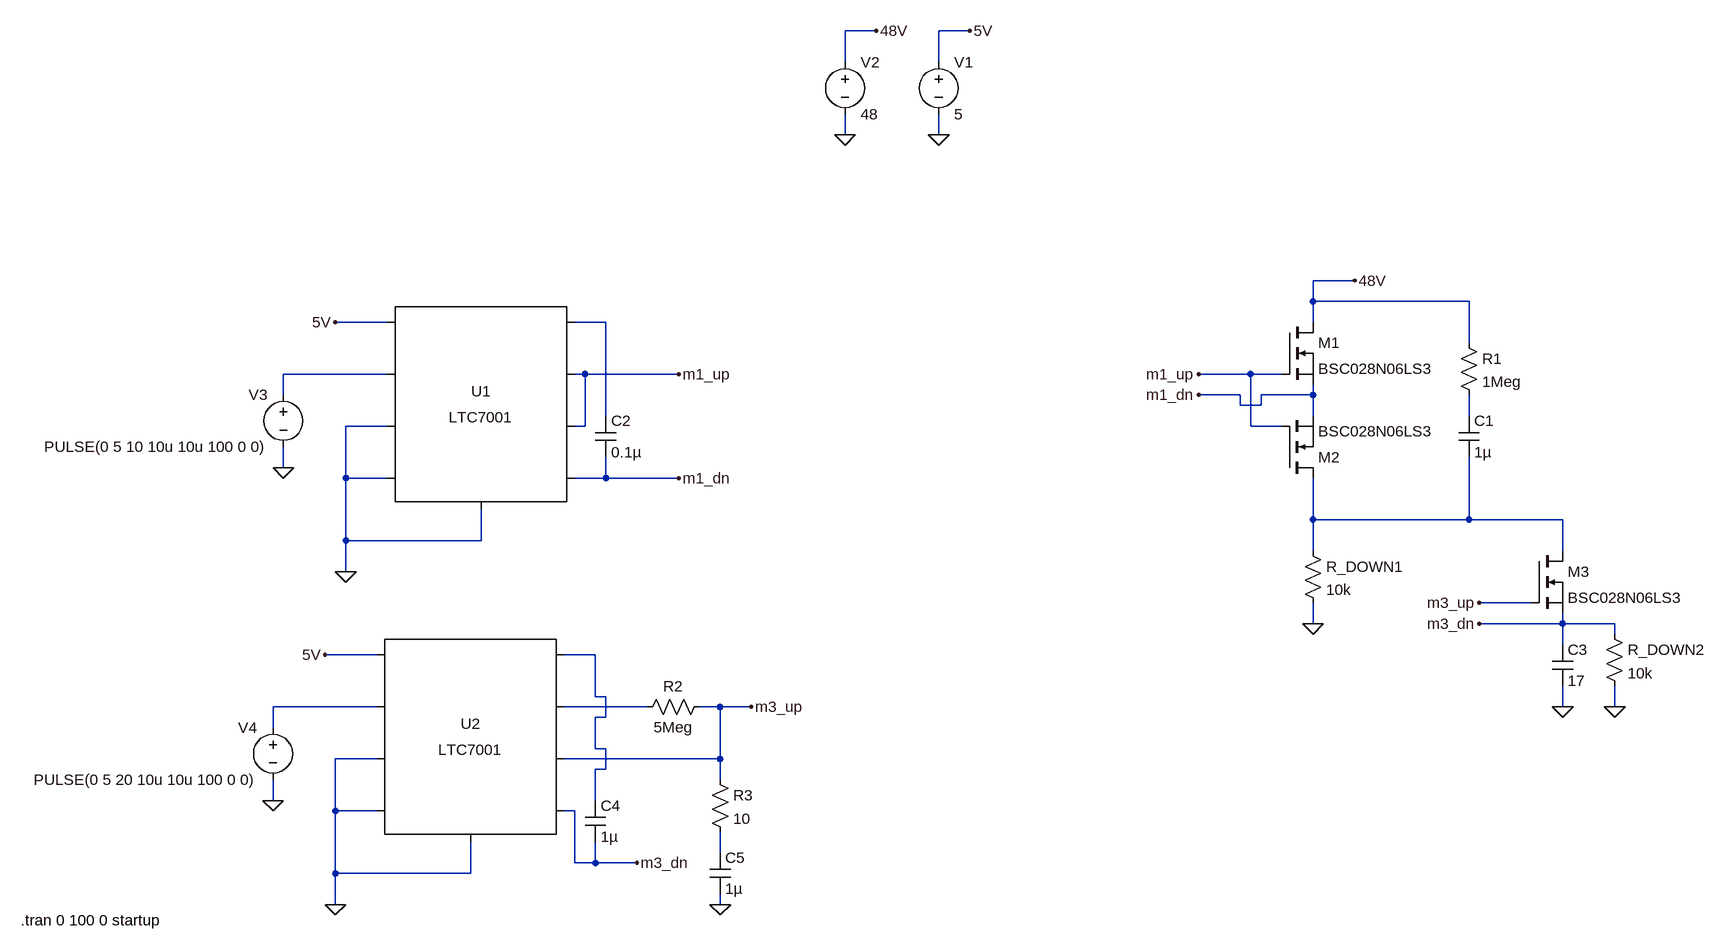
[diagram p0: schematic Draft1.asc]
Draft1.asc, the LTspice schematic file:
Version 4
SHEET 1 880 952
WIRE -688 -432 -736 -432
WIRE -544 -432 -592 -432
WIRE -736 -384 -736 -432
WIRE -592 -384 -592 -432
WIRE -736 -272 -736 -304
WIRE -592 -272 -592 -304
WIRE 48 -48 -16 -48
WIRE -16 -16 -16 -48
WIRE 224 -16 -16 -16
WIRE -1440 16 -1520 16
WIRE -1104 16 -1152 16
WIRE -16 16 -16 -16
WIRE 224 48 224 -16
WIRE -1440 96 -1600 96
WIRE -1136 96 -1152 96
WIRE -992 96 -1136 96
WIRE -112 96 -192 96
WIRE -64 96 -112 96
WIRE -1600 128 -1600 96
WIRE -128 128 -192 128
WIRE -16 128 -16 112
WIRE -16 128 -96 128
WIRE -128 144 -128 128
WIRE -96 144 -96 128
WIRE -96 144 -128 144
WIRE -1104 160 -1104 16
WIRE -16 160 -16 128
WIRE 224 160 224 128
WIRE -1440 176 -1504 176
WIRE -1136 176 -1136 96
WIRE -1136 176 -1152 176
WIRE -112 176 -112 96
WIRE -64 176 -112 176
WIRE -1600 240 -1600 208
WIRE -1504 256 -1504 176
WIRE -1440 256 -1504 256
WIRE -1104 256 -1104 224
WIRE -1104 256 -1152 256
WIRE -992 256 -1104 256
WIRE -16 320 -16 256
WIRE 224 320 224 224
WIRE 224 320 -16 320
WIRE 368 320 224 320
WIRE -1504 352 -1504 256
WIRE -1296 352 -1296 304
WIRE -1296 352 -1504 352
WIRE -16 368 -16 320
WIRE 368 368 368 320
WIRE -1504 400 -1504 352
WIRE 320 448 240 448
WIRE -16 480 -16 448
WIRE 368 480 368 464
WIRE 368 480 240 480
WIRE 448 480 368 480
WIRE 448 496 448 480
WIRE 368 512 368 480
WIRE -1456 528 -1536 528
WIRE -1120 528 -1168 528
WIRE -1120 592 -1120 528
WIRE -1104 592 -1120 592
WIRE -1456 608 -1616 608
WIRE -1040 608 -1168 608
WIRE -928 608 -960 608
WIRE -880 608 -928 608
WIRE 368 608 368 576
WIRE 448 608 448 576
WIRE -1104 624 -1104 592
WIRE -1104 624 -1120 624
WIRE -1616 640 -1616 608
WIRE -1120 672 -1120 624
WIRE -1104 672 -1120 672
WIRE -1456 688 -1520 688
WIRE -928 688 -928 608
WIRE -928 688 -1168 688
WIRE -1104 704 -1104 672
WIRE -1104 704 -1120 704
WIRE -928 720 -928 688
WIRE -1616 752 -1616 720
WIRE -1120 752 -1120 704
WIRE -1520 768 -1520 688
WIRE -1456 768 -1520 768
WIRE -1152 768 -1168 768
WIRE -928 832 -928 800
WIRE -1152 848 -1152 768
WIRE -1120 848 -1120 816
WIRE -1120 848 -1152 848
WIRE -1056 848 -1120 848
WIRE -1520 864 -1520 768
WIRE -1312 864 -1312 816
WIRE -1312 864 -1520 864
WIRE -1520 912 -1520 864
WIRE -928 912 -928 896
FLAG 48 -48 48V
FLAG -592 -272 0
FLAG -544 -432 5V
FLAG -736 -272 0
FLAG -688 -432 48V
FLAG -1520 16 5V
FLAG -1504 400 0
FLAG -1600 240 0
FLAG -16 480 0
FLAG 368 608 0
FLAG -992 96 m1_up
FLAG -992 256 m1_dn
FLAG -192 96 m1_up
FLAG -192 128 m1_dn
FLAG -1536 528 5V
FLAG -1520 912 0
FLAG -1616 752 0
FLAG -880 608 m3_up
FLAG -1056 848 m3_dn
FLAG 240 448 m3_up
FLAG 240 480 m3_dn
FLAG 448 608 0
FLAG -928 912 0
SYMBOL nmos -64 16 R0
SYMATTR InstName M1
SYMATTR Value BSC028N06LS3
SYMBOL nmos -64 256 M180
SYMATTR InstName M2
SYMATTR Value BSC028N06LS3
SYMBOL res 208 32 R0
SYMATTR InstName R1
SYMATTR Value 1Meg
SYMBOL cap 208 160 R0
SYMATTR InstName C1
SYMATTR Value 1µ
SYMBOL voltage -592 -400 R0
WINDOW 123 0 0 Left 0
WINDOW 39 0 0 Left 0
SYMATTR InstName V1
SYMATTR Value 5
SYMBOL voltage -736 -400 R0
WINDOW 123 0 0 Left 0
WINDOW 39 0 0 Left 0
SYMATTR InstName V2
SYMATTR Value 48
SYMBOL PowerProducts\\LTC7001 -1296 144 R0
SYMATTR InstName U1
SYMBOL cap -1120 160 R0
SYMATTR InstName C2
SYMATTR Value 0.1µ
SYMBOL voltage -1600 112 M0
WINDOW 123 0 0 Left 0
WINDOW 39 0 0 Left 0
SYMATTR InstName V3
SYMATTR Value PULSE(0 5 10 10u 10u 100 0 0)
SYMBOL res -32 352 R0
SYMATTR InstName R_DOWN1
SYMATTR Value 10k
SYMBOL nmos 320 368 R0
SYMATTR InstName M3
SYMATTR Value BSC028N06LS3
SYMBOL cap 352 512 R0
SYMATTR InstName C3
SYMATTR Value 17
SYMBOL PowerProducts\\LTC7001 -1312 656 R0
SYMATTR InstName U2
SYMBOL cap -1136 752 R0
SYMATTR InstName C4
SYMATTR Value 1µ
SYMBOL voltage -1616 624 M0
WINDOW 123 0 0 Left 0
WINDOW 39 0 0 Left 0
SYMATTR InstName V4
SYMATTR Value PULSE(0 5 20 10u 10u 100 0 0)
SYMBOL res 432 480 R0
SYMATTR InstName R_DOWN2
SYMATTR Value 10k
SYMBOL res -944 592 R90
WINDOW 0 0 56 VBottom 2
WINDOW 3 32 56 VTop 2
SYMATTR InstName R2
SYMATTR Value 5Meg
SYMBOL res -944 704 R0
SYMATTR InstName R3
SYMATTR Value 10
SYMBOL cap -944 832 R0
SYMATTR InstName C5
SYMATTR Value 1µ
TEXT -2004 936 Left 2 !.tran 0 100 0 startup

The netlist it stands for:
* Draft1.asc
M1 48V m1_up m1_dn m1_dn BSC028N06LS3
M2 N004 m1_up m1_dn m1_dn BSC028N06LS3
R1 48V N003 1Meg
C1 N003 N004 1µ
V1 5V 0 5
V2 48V 0 48
XU1 5V 0 0 N002 0 m1_up m1_up m1_dn N001 LTC7001
C2 N001 m1_dn 0.1µ
V3 N002 0 PULSE(0 5 10 10u 10u 100 0 0)
R_DOWN1 N004 0 10k
M3 N004 m3_up m3_dn m3_dn BSC028N06LS3
C3 m3_dn 0 17
XU2 5V 0 0 N006 0 m3_up N007 m3_dn N005 LTC7001
C4 N005 m3_dn 1µ
V4 N006 0 PULSE(0 5 20 10u 10u 100 0 0)
R_DOWN2 m3_dn 0 10k
R2 m3_up N007 5Meg
R3 m3_up N008 10
C5 N008 0 1µ
.model NMOS NMOS
.model PMOS PMOS
.lib standard.mos
.tran 0 100 0 startup
.lib LTC7001.sub
.backanno
.end